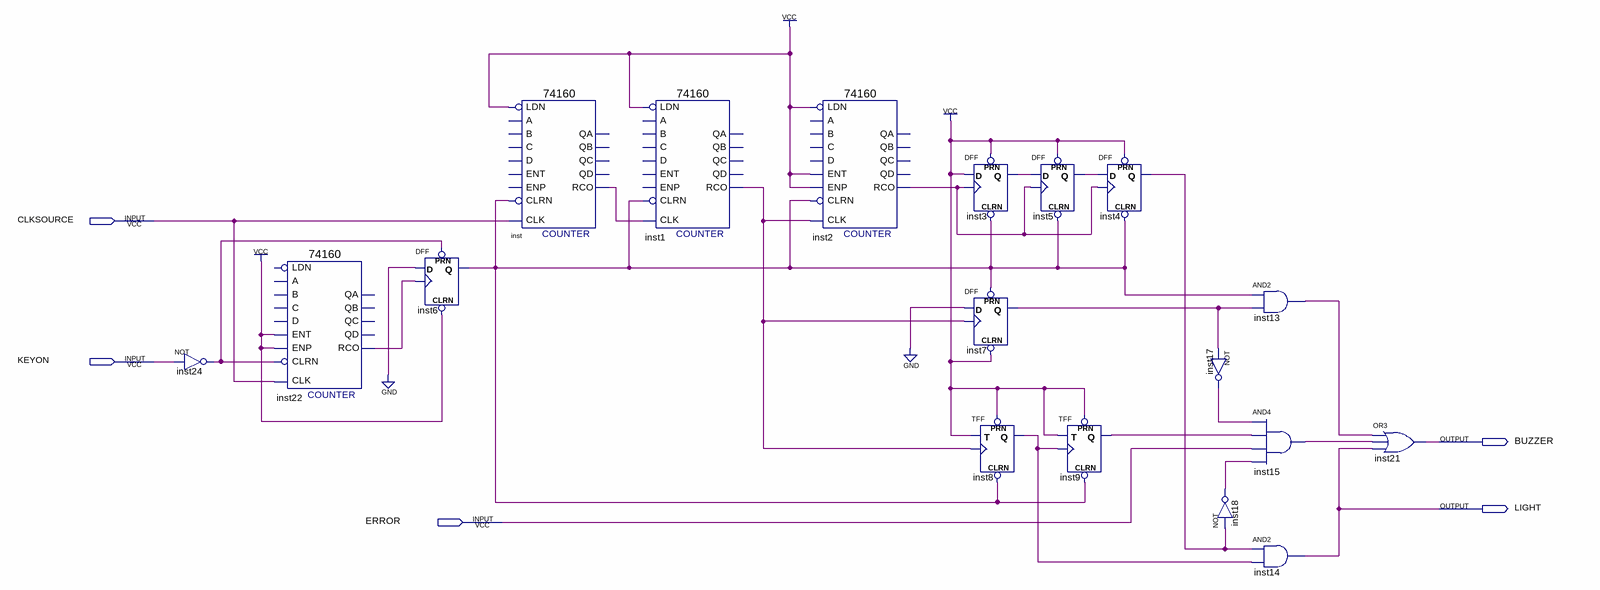
[diagram p0: schematic sheet]
// Quartus schematic buzzer.bdf as structural Verilog: 18 symbols, 5 pins
module buzzer (
  input  CLKSOURCE,
  input  KEYON,
  input  ERROR,
  output BUZZER,
  output LIGHT
);

  wire inst1_rco, inst2_rco, inst3_q, inst4_q, inst5_q, inst6_q, inst7_q, inst8_q, inst9_q, inst13_out,
       inst15_out, inst17_out, inst18_out, inst22_rco, inst24_out, inst_rco;

  not inst24 (inst24_out, KEYON);
  \74160  inst22 (
    .CLK(CLKSOURCE), .ENT(1'b1), .ENP(1'b1), .CLRN(inst24_out), .RCO(inst22_rco));  // open: A, B, C, D, LDN, QD, QA, QB, QC
  DFF inst6 (.CLRN(1'b1), .CLK(inst22_rco), .D(1'b0), .PRN(inst24_out), .Q(inst6_q));
  \74160  inst (
    .CLK(CLKSOURCE), .LDN(1'b1), .CLRN(inst6_q), .RCO(inst_rco));  // open: ENT, A, B, C, D, ENP, QD, QA, QB, QC
  \74160  inst1 (
    .CLK(inst_rco), .LDN(1'b1), .CLRN(inst6_q), .RCO(inst1_rco));  // open: ENT, A, B, C, D, ENP, QD, QA, QB, QC
  \74160  inst2 (
    .CLK(inst1_rco), .ENT(1'b1), .LDN(1'b1), .ENP(1'b1), .CLRN(inst6_q), .RCO(inst2_rco));  // open: A, B, C, D, QD, QA, QB, QC
  DFF inst3 (.CLRN(inst6_q), .CLK(inst2_rco), .D(1'b1), .PRN(1'b1), .Q(inst3_q));
  DFF inst7 (.CLRN(1'b1), .CLK(inst1_rco), .D(1'b0), .PRN(inst6_q), .Q(inst7_q));
  TFF inst8 (.PRN(1'b1), .CLRN(inst6_q), .T(1'b1), .CLK(inst1_rco), .Q(inst8_q));
  DFF inst5 (.CLRN(inst6_q), .CLK(inst2_rco), .D(inst3_q), .PRN(1'b1), .Q(inst5_q));
  DFF inst4 (.CLRN(inst6_q), .CLK(inst2_rco), .D(inst5_q), .PRN(1'b1), .Q(inst4_q));
  TFF inst9 (.PRN(1'b1), .CLRN(inst6_q), .T(1'b1), .CLK(inst8_q), .Q(inst9_q));
  not inst17 (inst17_out, inst7_q);
  and inst13 (inst13_out, inst6_q, inst7_q);
  and inst15 (inst15_out, inst17_out, inst9_q, ERROR, inst18_out);
  not inst18 (inst18_out, inst4_q);
  and inst14 (LIGHT, inst4_q, inst8_q);
  or inst21 (BUZZER, inst13_out, inst15_out, LIGHT);
endmodule
